# EAGLE design ampValve (EAGLE 9.4.2)
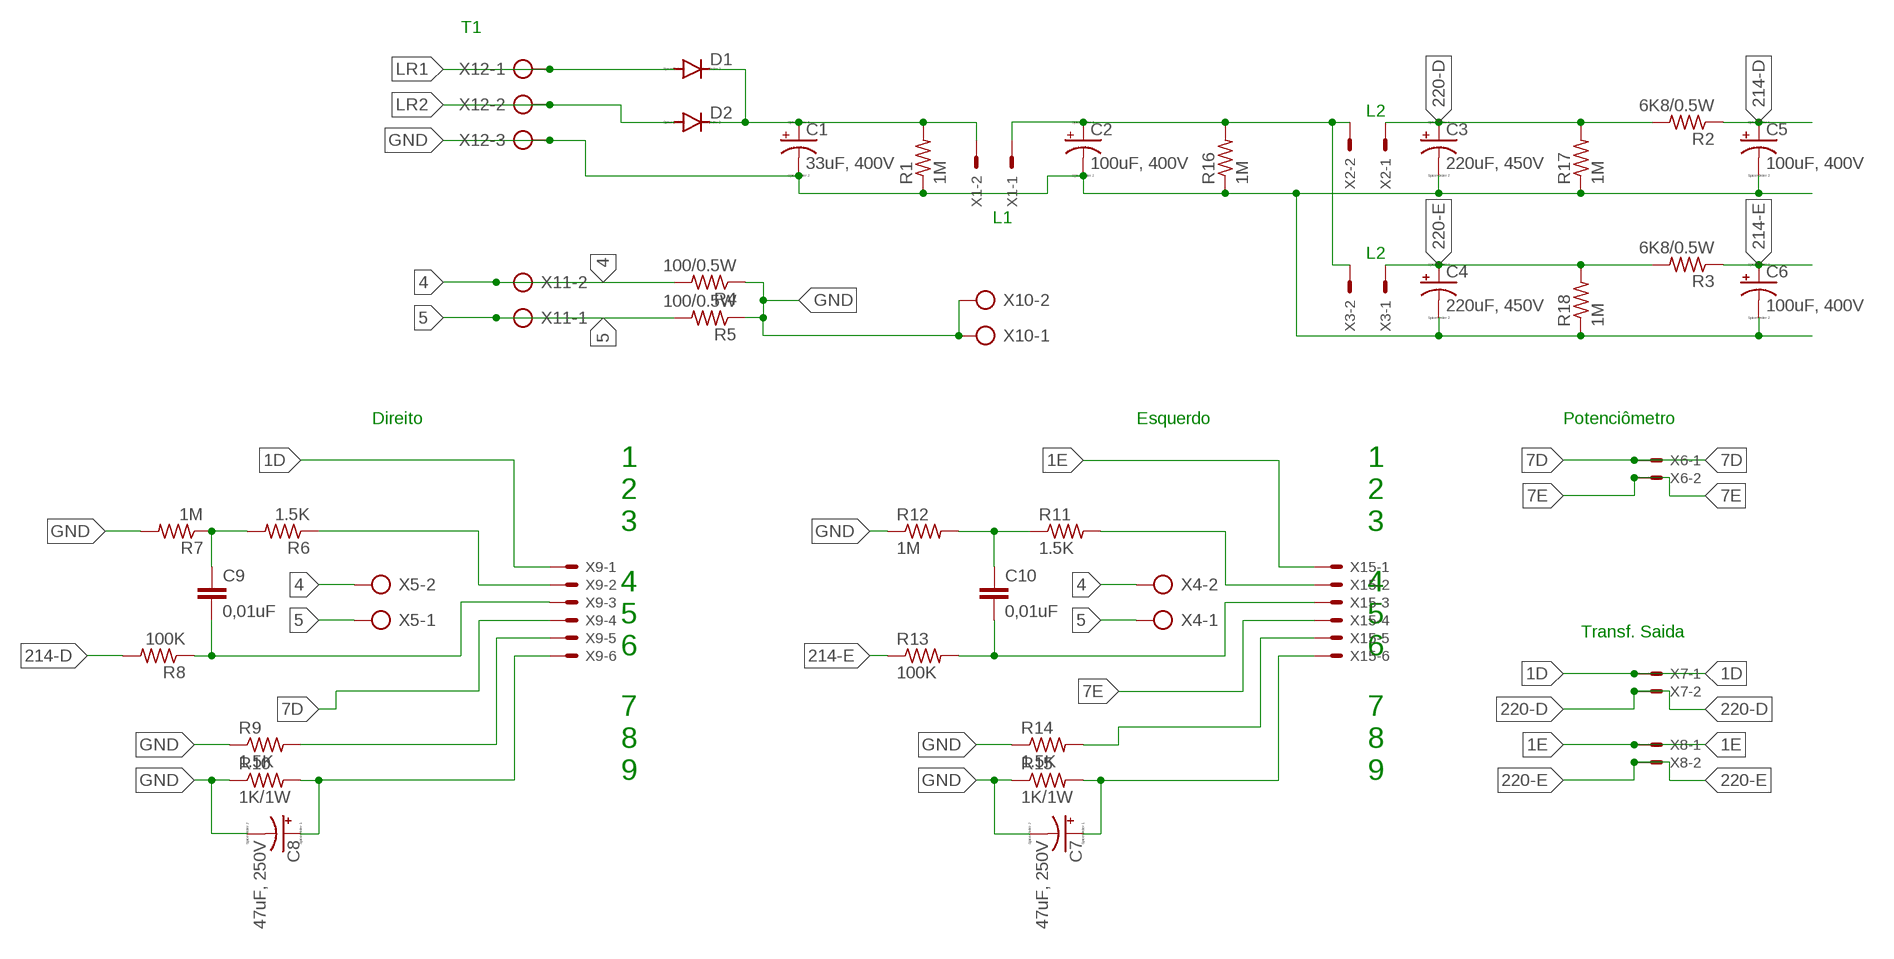
[diagram p0: schematic, sheet 1]

## Parts
C1  33uF, 400V  CPOL-USE7.5-16  [E7,5-16]
C2  100uF, 400V  CPOL-USE7.5-18  [E7,5-18]
C3  220uF, 450V  CPOL-USE10-25  [EB25D]
C4  220uF, 450V  CPOL-USE10-25  [EB25D]
C5  100uF, 400V  CPOL-USE7.5-18  [E7,5-18]
C6  100uF, 400V  CPOL-USE7.5-18  [E7,5-18]
C7  47uF, 250V  CPOL-USE5-13  [E5-13]
C8  47uF, 250V  CPOL-USE5-13  [E5-13]
C9  0,01uF  C-EU102-043X133  [C102-043X133]
C10  0,01uF  C-EU102-043X133  [C102-043X133]
D1  DIODE-D-12.5  [D-12.5]
D2  DIODE-D-12.5  [D-12.5]
R1  1M  R-US_0207/10  [0207/10]
R2  6K8/0.5W  R-US_0207/10  [0207/10]
R3  6K8/0.5W  R-US_0207/10  [0207/10]
R4  100/0.5W  R-US_0207/10  [0207/10]
R5  100/0.5W  R-US_0207/10  [0207/10]
R6  1.5K  R-US_0207/10  [0207/10]
R7  1M  R-US_0207/10  [0207/10]
R8  100K  R-US_0207/10  [0207/10]
R9  1.5K  R-US_0207/10  [0207/10]
R10  1K/1W  R-US_0207/10  [0207/10]
R11  1.5K  R-US_0207/10  [0207/10]
R12  1M  R-US_0207/10  [0207/10]
R13  100K  R-US_0207/10  [0207/10]
R14  1.5K  R-US_0207/10  [0207/10]
R15  1K/1W  R-US_0207/10  [0207/10]
R16  1M  R-US_0207/10  [0207/10]
R17  1M  R-US_0207/10  [0207/10]
R18  1M  R-US_0207/10  [0207/10]
X1  KK-156-2  [KK-156-2]
X2  KK-156-2  [KK-156-2]
X3  KK-156-2  [KK-156-2]
X4  AK500/2-H  [AK500/2-H]
X5  AK500/2-H  [AK500/2-H]
X6  KK-156-2  [KK-156-2]
X7  KK-156-2  [KK-156-2]
X8  KK-156-2  [KK-156-2]
X9  KK-156-6  [KK-156-6]
X10  AK500/2-H  [AK500/2-H]
X11  AK500/2-H  [AK500/2-H]
X12  AK500/3-H  [AK500/3-H]
X15  KK-156-6  [KK-156-6]

## Nets
1D: X7.1 X9.1
1E: X8.1 X15.1
4: R4.2 X4.2 X5.2 X11.2
5: R5.2 X4.1 X5.1 X11.1
7D: X6.1 X9.4
7E: X6.2 X15.4
214-D: C5.+ R2.1 R8.2
214-E: C6.+ R3.1 R13.1
220-D: C3.+ R2.2 R17.2 X2.1 X7.2
220-E: C4.+ R3.2 R18.2 X3.1 X8.2
GND: C1.- C2.- C3.- C4.- C5.- C6.- C7.- C8.- R1.1 R4.1 R5.1 R7.2 R9.1 R10.1 R12.1 R14.1 R15.1 R16.1 R17.1 R18.1 X10.1 X10.2 X12.3
LR1: D1.A X12.1
LR2: D2.A X12.2
N$1: C1.+ D1.C D2.C R1.2 X1.2
N$2: C2.+ R16.2 X1.1 X2.2 X3.2
N$3: C9.2 R8.1 X9.3
N$4: C10.2 R13.2 X15.3
N$5: R14.2 X15.5
N$6: R9.2 X9.5
N$7: C9.1 R6.2 R7.1
N$8: R6.1 X9.2
N$9: C10.1 R11.1 R12.2
N$10: R11.2 X15.2
N$13: C7.+ R15.2 X15.6
N$17: C8.+ R10.2 X9.6

## Notes on the sheet
- T1
- L2
- L1
- L2
- Direito | Esquerdo | Potenciômetro
- 1
  2
  3
- 1
  2
  3
- Transf. Saida
- 4
  5
  6
- 4
  5
  6
- 7
  8
  9
- 7
  8
  9

## Library data of the parts
C1-C8 = resistor:CPOL-US: POLARIZED CAPACITOR, American symbol
C9 C10 = resistor_novo:C-EU: CAPACITOR, European symbol
D1 D2 = diode_novo:DIODE-: DIODE
R1-R18 = resistor_novo:R-US_: RESISTOR, American symbol
X1-X3 X6-X8 = con-molex:KK-156-2: KK 156 HEADER Source: http://www.molex.com/pdm_docs/sd/026604100_sd.pdf; MF: MOLEX; OC_FARNELL: unknown; OC_NEWARK: unknown
X4 X5 X10 X11 = con-ptr500:AK500/2-H: CONNECTOR Aug. 2004 / PTR Meßtechnik: Die Bezeichnung der Serie AK505 wurde geändert. Es handelt sich hierbei um AK500 in horizontaler Ausführung.; OC_FARNELL: unknown; OC_NEWARK: unknown
X9 X15 = con-molex:KK-156-6: KK 156 HEADER Source: http://www.molex.com/pdm_docs/sd/026604100_sd.pdf; MF: MOLEX; OC_FARNELL: unknown; OC_NEWARK: unknown
X12 = con-ptr500:AK500/3-H: CONNECTOR Aug. 2004 / PTR Meßtechnik: Die Bezeichnung der Serie AK505 wurde geändert. Es handelt sich hierbei um AK500 in horizontaler Ausführung.; OC_FARNELL: unknown; OC_NEWARK: unknown

## Board
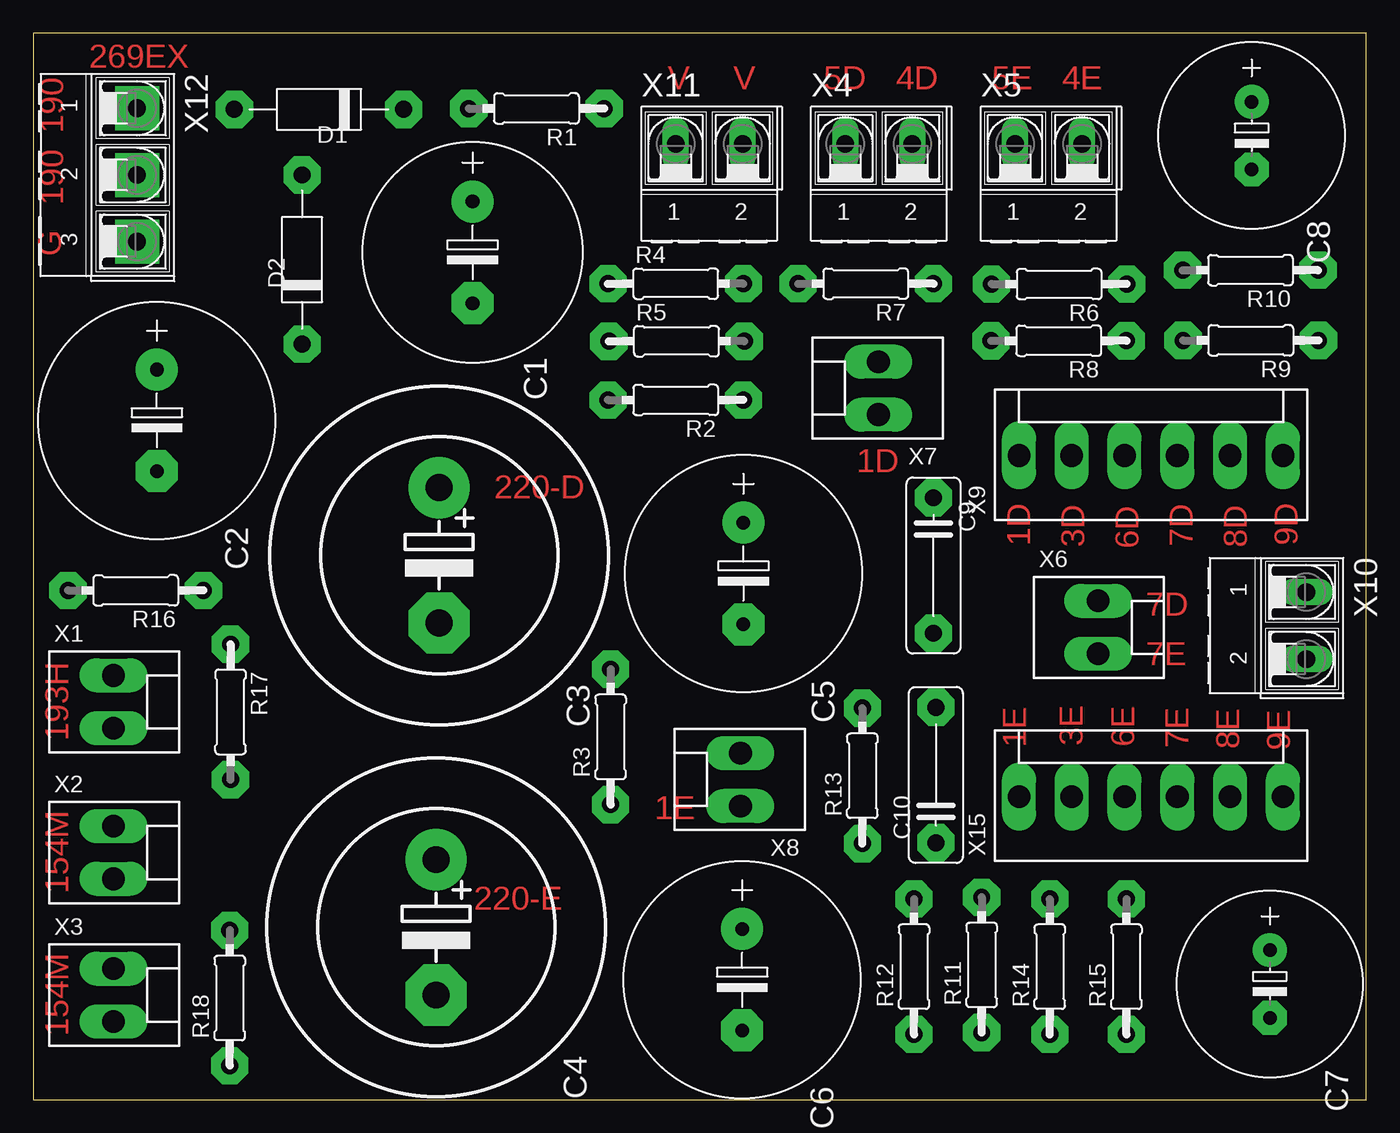
[diagram p1: board, top side]
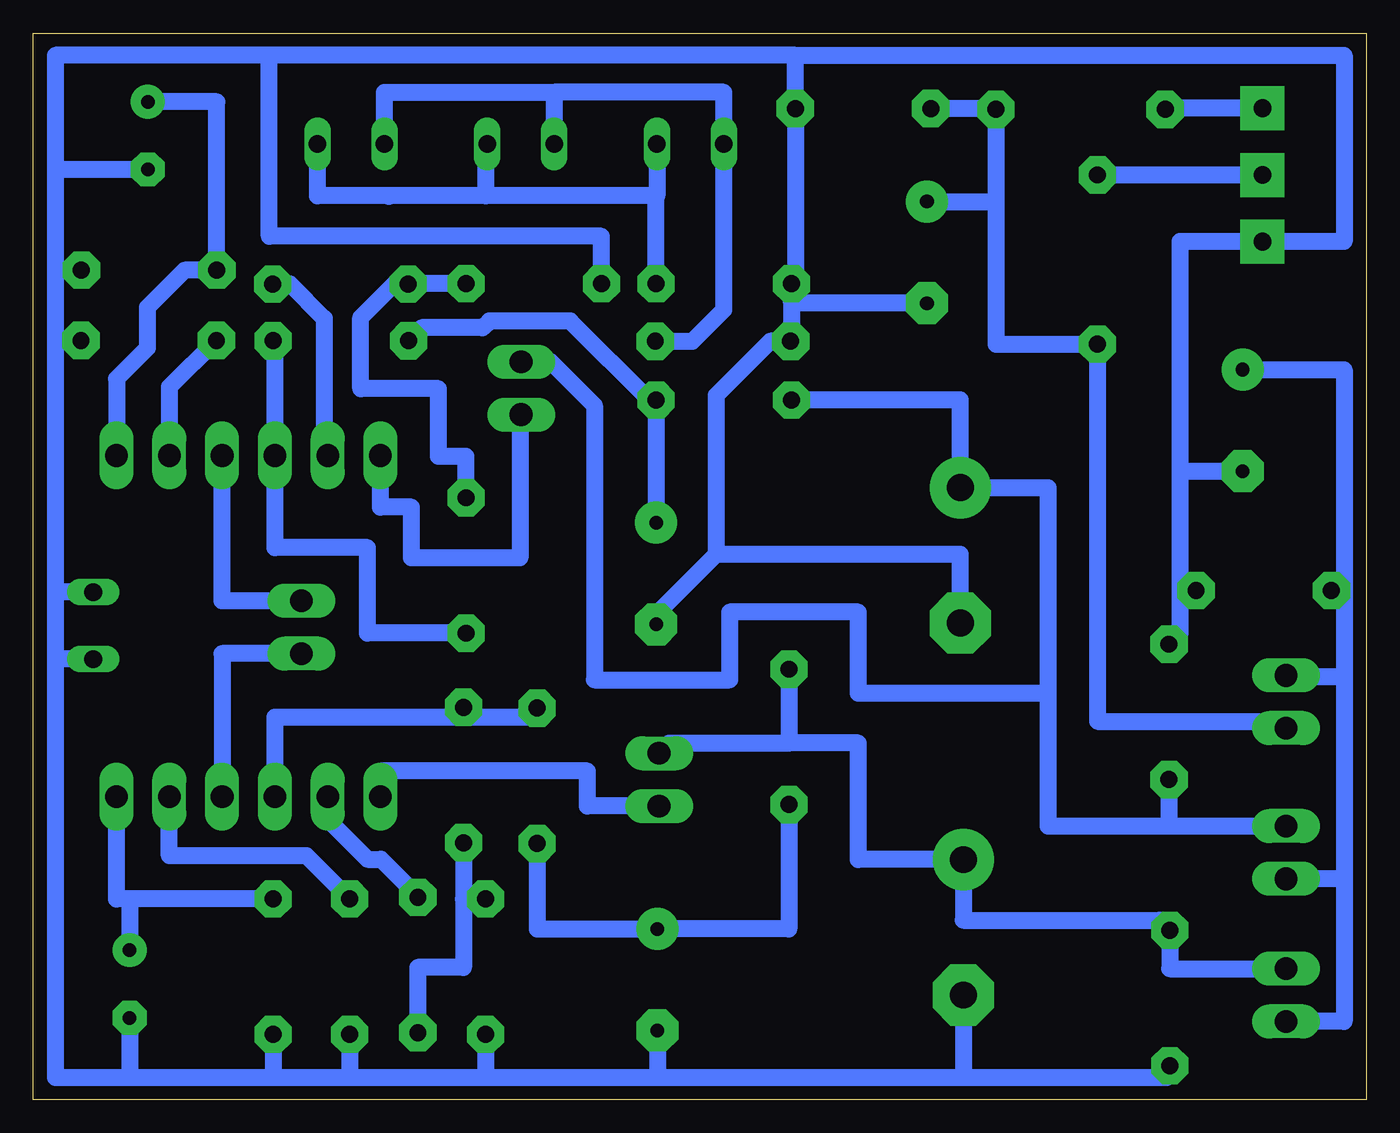
[diagram p2: board, bottom side, seen from below]

Size 100 x 80 mm. Coordinates in mm from the lower left corner, seen from the top.
Outline: 0,0 100,0 100,80 0,80 0,0
Copper layers (1*16): Top 0.035mm / dielectric 1.5mm / Bottom 0.035mm
Design rules "default": minimum track width 6mil, minimum drill 0.35mm, track to track 6mil, track to pad 6mil, pad to pad 6mil, via to via 6mil, smd to smd 6mil, copper to edge 40mil, drill to drill 6mil, minimum pad ring 10mil, minimum via ring 8mil, stop-mask expansion 4mil, vias tented up to drill 0mil, thermal gap 10mil

### Footprints (pad centres in the part's own frame; a part is rotated, then mirrored left to right if it is on the bottom)
E7,5-16 = drill 1.016 pad 3.15: + -3.81,0 | drill 1.016 pad 3.15 octagon: - 3.81,0
E7,5-18 = drill 1.016 pad 3.15: + -3.81,0 | drill 1.016 pad 3.15 octagon: - 3.81,0
EB25D = drill 2.007 pad 4.597: + -5.08,0 | drill 2.007 pad 4.597 octagon: - 5.08,0
E5-13 = drill 1.016 pad 2.54: + -2.54,0 | drill 1.016 pad 2.54 octagon: - 2.54,0
C102-043X133 = drill 1.27 pad 2.794 octagon: 1 -5.08,0; 2 5.08,0
D-12.5 = drill 1.27 pad 2.794 octagon: A 6.35,0; C -6.35,0
0207/10 = drill 1.27 pad 2.794 octagon: 1 -5.08,0; 2 5.08,0
KK-156-2 = drill 1.7 pad 2.184 long: 1 -1.98,0; 2 1.98,0
AK500/2-H = drill 1.321 long: 1 -2.515,0; 2 2.515,0
KK-156-6 = drill 1.7 pad 2.184 long: 1 -9.9,0; 2 -5.94,0; 3 -1.98,0; 4 1.98,0; 5 5.94,0; 6 9.9,0
AK500/3-H = drill 1.321 pad 3.302 square: 1 -5.004,0; 2 0,0; 3 5.004,0

### Placement (x,y rotation side)
C1  32.96,63.56 270 top
C2  9.27,50.96 270 top
C3  30.45,40.83 270 top
C4  30.23,12.92 270 top
C5  53.28,39.47 270 top
C6  53.18,8.99 270 top
C7  92.77,8.67 270 top
C8  91.41,72.33 270 top
C9  67.53,40.07 270 top
C10  67.72,24.35 90 top
D1  21.43,74.3 180 top
D2  20.16,63.02 90 top
R1  37.75,74.36 180 top
R2  48.2,52.48 180 top
R3  43.31,27.21 90 top
R4  48.2,61.21 0 top
R5  48.26,56.9 0 top
R6  76.96,61.18 180 top
R7  62.45,61.21 180 top
R8  76.93,56.93 180 top
R9  91.34,56.96 180 top
R10  91.31,62.23 180 top
R11  71.15,10.1 90 top
R12  66.07,9.97 90 top
R13  62.2,24.29 90 top
R14  76.26,9.97 90 top
R15  82.01,9.97 90 top
R16  7.68,38.2 180 top
R17  14.8,29.08 270 top
R18  14.73,7.62 90 top
X1  6,29.84 270 top
X2  6,18.54 270 top
X3  6,7.84 270 top
X4  63.44,71.69 0 top
X5  76.17,71.69 0 top
X6  79.88,35.43 270 top
X7  63.4,53.37 90 top
X8  53.05,24 90 top
X9  83.85,48.32 0 top
X10  95.5,35.56 270 top
X11  50.7,71.69 0 top
X12  7.78,69.37 270 top
X15  83.85,22.73 0 top

### Tracks (layer width: path | path; a pad name or v marks a point on that pad's centre or on a via)
1D
  Bottom 1.27: X7.1 63.5,51.39 63.5,40.64 71.63,40.64 71.63,44.45 73.95,44.45 X9.1
1E
  Bottom 1.27: X8.1 58.42,22.02 58.42,24.64 73.95,24.64 X15.1
4
  Bottom 1.27: X11.2 53.22,67.82 53.28,67.82 | 53.28,67.82 66.04,67.82 | 66.04,67.82 66.04,71.69 X4.2 | 66.04,67.82 73.41,67.82 | 73.41,67.82 78.68,67.82 X5.2 | 73.34,67.75 73.41,67.82 | R4.2 53.28,67.82
5
  Bottom 1.27: 60.92,75.56 X4.1 | 60.92,75.56 48.19,75.56 X11.1 48.19,59.25 50.55,56.9 R5.2 | 60.92,75.56 73.65,75.56 X5.1
7D
  Bottom 1.27: X6.1 85.83,37.41 X9.4
7E
  Bottom 1.27: X6.2 85.83,33.45 X15.4
214-D
  Bottom 1.27: C5.+ R2.1 53.78,52.48 59.72,58.42 65.79,58.42 66.29,57.91 70.87,57.91 R8.2
214-E
  Bottom 1.27: R3.1 43.31,12.79 C6.+ 62.2,12.79 R13.1
220-D
  Bottom 1.27: 14.8,20.52 23.88,20.52 23.88,30.48 | 14.8,20.52 X2.1 | 23.88,30.48 23.88,45.91 C3.+ 30.45,52.48 R2.2 | R17.2 14.8,20.52 | 23.88,30.48 38.1,30.48 38.1,36.58 47.75,36.58 47.75,31.5 57.91,31.5 57.91,52.07 61.19,55.35 X7.2
220-E
  Bottom 1.27: X3.1 14.73,9.82 R18.2 15.49,13.46 30.23,13.46 C4.+ 38.1,18 38.1,26.75 43.31,26.75 | X8.2 52.29,26.75 43.31,26.75 | R3.2 43.31,26.75
GND
  Bottom 1.27: 42.83,78.35 1.65,78.35 1.65,64.37 X12.3 13.97,64.37 13.97,47.15 | 42.83,78.35 82.3,78.35 | 82.3,78.35 98.35,78.35 98.35,69.79 | 98.35,69.79 98.35,62.23 | 98.35,62.23 98.35,56.96 | 98.35,56.96 98.35,38.1 | 98.35,38.1 98.35,33.05 | 98.35,33.05 98.35,1.65 92.96,1.65 | 92.96,1.65 82.04,1.65 | 82.04,1.65 76.26,1.65 | 76.26,1.65 66.07,1.65 | 66.07,1.65 53.18,1.65 | 53.18,1.65 30.23,1.65 | 30.23,1.65 14.99,1.65 14.99,2.54 R18.1 | 13.97,47.15 C2.- | C4.- 30.23,1.65 | R16.1 13.97,38.2 | 13.97,38.2 13.97,34.99 R17.1 | C6.- 53.18,1.65 | 42.83,78.35 R1.1 42.83,61.21 R4.1 | R15.1 82.01,1.68 82.04,1.65 | C7.- 92.77,1.84 92.96,1.65 | R14.1 76.26,1.65 | R12.1 66.07,1.65 | R9.1 98.35,56.96 | R10.1 98.35,62.23 | C8.- 98.35,69.79 | C1.- 43.12,59.75 R4.1 | R4.1 43.12,56.9 R5.1 44.7,56.9 48.77,52.83 48.77,40.89 | C3.- 30.45,40.89 48.77,40.89 | R7.2 57.37,64.77 82.3,64.77 82.3,78.35 | X10.1 95.5,38.1 98.35,38.1 | X10.2 98.35,33.05 | 13.97,47.15 13.97,38.2 | 48.77,40.89 53.28,36.39 C5.-
LR1
  Bottom 1.27: X12.1 15.08,74.38 D1.A
LR2
  Bottom 1.27: X12.2 D2.A
N$1
  Bottom 1.27: 27.78,67.37 D1.C 27.78,74.36 R1.2 | 27.78,67.37 27.78,56.67 D2.C 20.16,28.37 6.51,28.37 X1.2 | C1.+ 27.78,67.37
N$2
  Bottom 1.27: 1.65,16.56 X2.2 | 1.65,16.56 1.65,5.86 X3.2 | C2.+ 1.65,54.77 1.65,38.1 | 1.65,38.1 1.65,31.75 | 1.65,31.75 1.65,16.56 | X1.1 6,31.75 1.65,31.75 | R16.2 2.6,38.1 1.65,38.1
N$3
  Bottom 1.27: C9.2 74.93,34.99 74.93,41.4 81.87,41.4 X9.3 81.87,56.93 R8.1
N$4
  Bottom 1.27: X15.3 81.87,28.7 67.72,28.7 | C10.2 67.72,28.7 | 67.72,28.7 62.2,28.7 R13.2
N$5
  Bottom 1.27: R14.2 79.5,18.29 89.79,18.29 X15.5
N$6
  Bottom 1.27: R9.2 86.3,56.96 89.79,53.46 X9.5
N$7
  Bottom 1.27: R7.1 71.85,61.21 R6.2 72.93,61.18 75.44,58.67 75.44,53.34 69.6,53.34 69.6,48.26 67.53,48.26 C9.1
N$8
  Bottom 1.27: X9.2 78.17,48.58 78.17,58.61 80.74,61.18 R6.1
N$9
  Bottom 1.27: C10.1 67.72,15.05 | 67.72,15.05 R12.2 | 67.72,15.05 67.72,9.91 71.15,9.91 R11.1
N$10
  Bottom 1.27: X15.2 77.91,21.02 74.93,18.03 73.91,18.03 71.15,15.27 R11.2
N$13
  Bottom 1.27: R15.2 92.77,15.05 | 92.77,15.05 C7.+ | 92.77,15.05 93.75,15.05 X15.6
N$17
  Bottom 1.27: C8.+ 86.23,74.87 R10.2 88.65,62.23 91.44,59.44 91.44,56.39 93.75,54.08 X9.6

### Text on the board
Top: 269EX | V | V | 5D | 4D | 5E | 4E | 190 | 190 | G | 1D | 220-D | 1D | 3D | 6D | 7D | 8D | 9D | 7D | 193H | 7E | 3E | 6E | 1E | 7E | 8E | 9E | 154M | 1E | 220-E | 154M